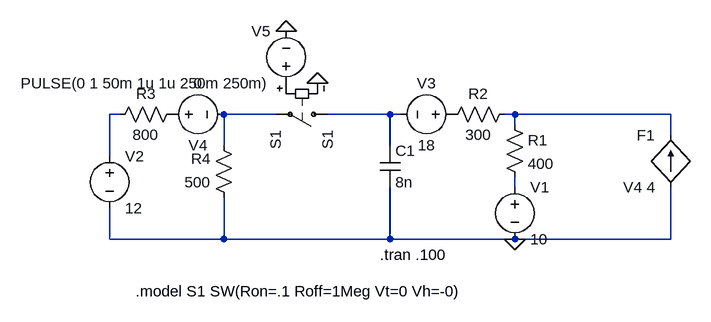
[diagram p0: schematic pas63.asc]
pas63.asc, the LTspice schematic file:
Version 4.1
SHEET 1 880 680
WIRE -448 32 -464 32
WIRE -208 32 -288 32
WIRE -32 32 -128 32
WIRE -16 32 -32 32
WIRE 160 32 144 32
WIRE 400 32 160 32
WIRE 160 48 160 32
WIRE 400 64 400 32
WIRE -288 80 -288 32
WIRE -32 80 -32 32
WIRE -464 96 -464 32
WIRE 160 144 160 128
WIRE -464 224 -464 176
WIRE -288 224 -288 160
WIRE -288 224 -464 224
WIRE -32 224 -32 144
WIRE -32 224 -288 224
WIRE 160 224 -32 224
WIRE 400 224 400 144
WIRE 400 224 160 224
FLAG 160 224 0
FLAG -192 -96 0
FLAG -144 -16 0
SYMBOL voltage 160 128 R0
WINDOW 123 0 0 Left 0
WINDOW 39 0 0 Left 0
SYMATTR InstName V1
SYMATTR Value 10
SYMBOL res 144 32 R0
SYMATTR InstName R1
SYMATTR Value 400
SYMBOL res 160 16 R90
WINDOW 0 0 56 VBottom 2
WINDOW 3 32 56 VTop 2
SYMATTR InstName R2
SYMATTR Value 300
SYMBOL voltage -464 80 R0
SYMATTR InstName V2
SYMATTR Value 12
SYMBOL res -352 16 R90
WINDOW 0 0 56 VBottom 2
WINDOW 3 32 56 VTop 2
SYMATTR InstName R3
SYMATTR Value 800
SYMBOL res -272 176 R180
WINDOW 0 36 76 Left 2
WINDOW 3 36 40 Left 2
SYMATTR InstName R4
SYMATTR Value 500
SYMBOL f 400 144 R180
WINDOW 0 24 80 Left 2
WINDOW 3 24 0 Left 2
SYMATTR InstName F1
SYMATTR Value V4 4
SYMBOL voltage 80 32 R90
WINDOW 0 -32 56 VBottom 2
WINDOW 3 32 56 VTop 2
SYMATTR InstName V3
SYMATTR Value 18
SYMBOL voltage -384 32 R270
WINDOW 0 -32 56 VBottom 2
WINDOW 3 32 56 VTop 2
WINDOW 123 0 0 Left 0
WINDOW 39 0 0 Left 0
SYMATTR InstName V4
SYMATTR Value 0
SYMBOL cap -48 80 R0
SYMATTR InstName C1
SYMATTR Value 8n
SYMBOL sw -112 32 R90
SYMATTR InstName S1
SYMATTR Value S1
SYMBOL voltage -192 0 R180
WINDOW 0 24 96 Left 2
WINDOW 3 24 16 Left 2
WINDOW 123 0 0 Left 0
WINDOW 39 0 0 Left 0
SYMATTR InstName V5
SYMATTR Value PULSE(0 1 50m 1u 1u 250m 250m)
TEXT -48 248 Left 2 !.tran .100
TEXT -424 304 Left 2 !.model S1 SW(Ron=.1 Roff=1Meg Vt=0 Vh=-0)

The netlist it stands for:
* pas63.asc
V1 N005 0 10
R1 N004 N005 400
R2 N004 P001 300
V2 N001 0 12
R3 P002 N001 800
R4 0 N002 500
F1 0 N004 V4 4
V3 P001 N003 18
V4 P002 N002 0
C1 N003 0 8n
S1 N003 N002 P003 0 S1
V5 P003 0 PULSE(0 1 50m 1u 1u 250m 250m)
.tran .100
.model S1 SW(Ron=.1 Roff=1Meg Vt=0 Vh=-0)
.backanno
.end